# EAGLE schematic servo_ext (EAGLE 9.6.2)
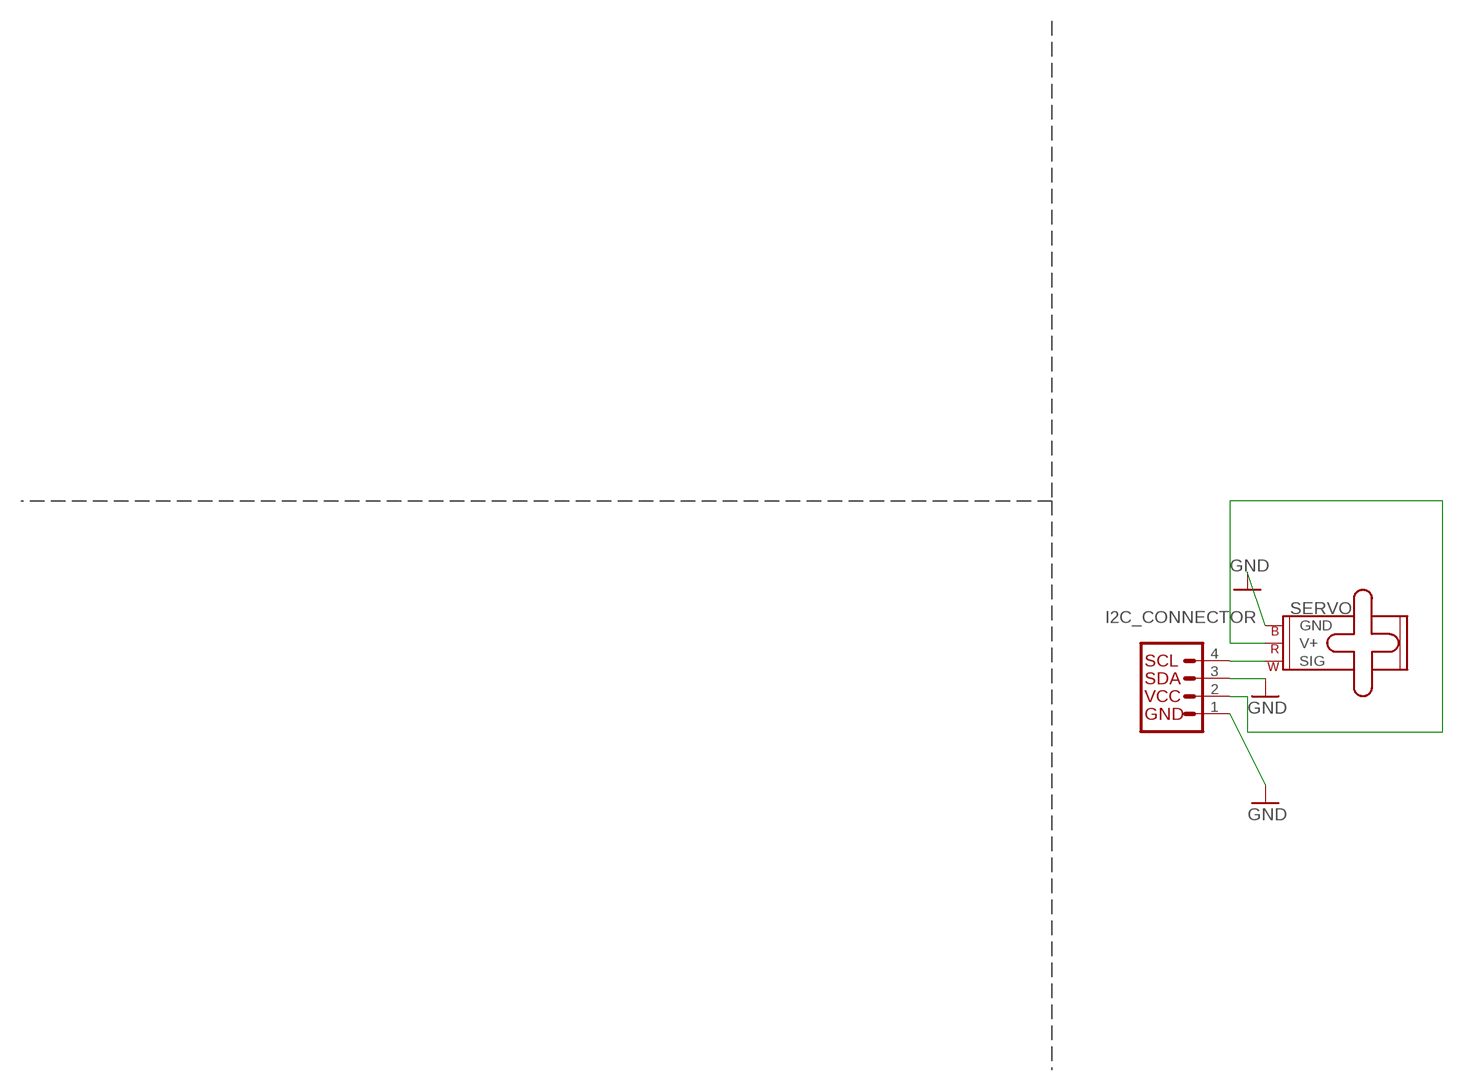
[diagram p0: schematic, sheet 1]

## Parts
I2C_CONNECTOR  QWIIC_CONNECTORJS-1MM  [JST04_1MM_RA]
M1  SERVO  [1X03]

## Nets
GND: I2C_CONNECTOR.1 I2C_CONNECTOR.3 M1.3(GND)
N$1: I2C_CONNECTOR.4 M1.1(SIG)
N$2: I2C_CONNECTOR.2 M1.2(V+)

## Library data of the parts
I2C_CONNECTOR = SparkFun-Connectors:QWIIC_CONNECTOR: SparkFun I2C Standard Qwiic Connector An SMD 1mm pitch JST connector makes it easy and quick (get it? Qwiic?) to connect I2C devices to each other. The Qwiic system <http://www.sparkfun.com/qwiic> enables fast and solderless connection between popular platforms and various sensors and actuators. We carry 200mm <https://www.sparkfun.com/products/14204>, 100mm <https://www.sparkfun.com/products/14205>, 50mm <https://www.sparkfun.com/products/14206>, and breadboard friendly <https://www.sparkfun.com/products/14207> Qwiic cables. We also offer 10 pcs strips <https://www.sparkfun.com/products/14323> the SMD connectors.; PROD_ID: CONN-13694; VALUE: QWIIC_RIGHT_ANGLE
M1 = SparkFun-Electromechanical:SERVO: Servo Motor 3-pin connector for a standard servo motor (voltage supply, ground, and control signal.) SparkFun Products Servo - Generic (Sub-Micro Size) <https://www.sparkfun.com/products/9065> (ROB-09065) Servo - Generic High Torque Continuous Rotation (Standard Size) <https://www.sparkfun.com/products/9347> (ROB-09347) Servo - Generic High Torque (Standard Size) <https://www.sparkfun.com/products/11965> (ROB-11965)

## Net classes
1 power: width 0.305 mm